# EAGLE design hackerling (EAGLE 6.4)
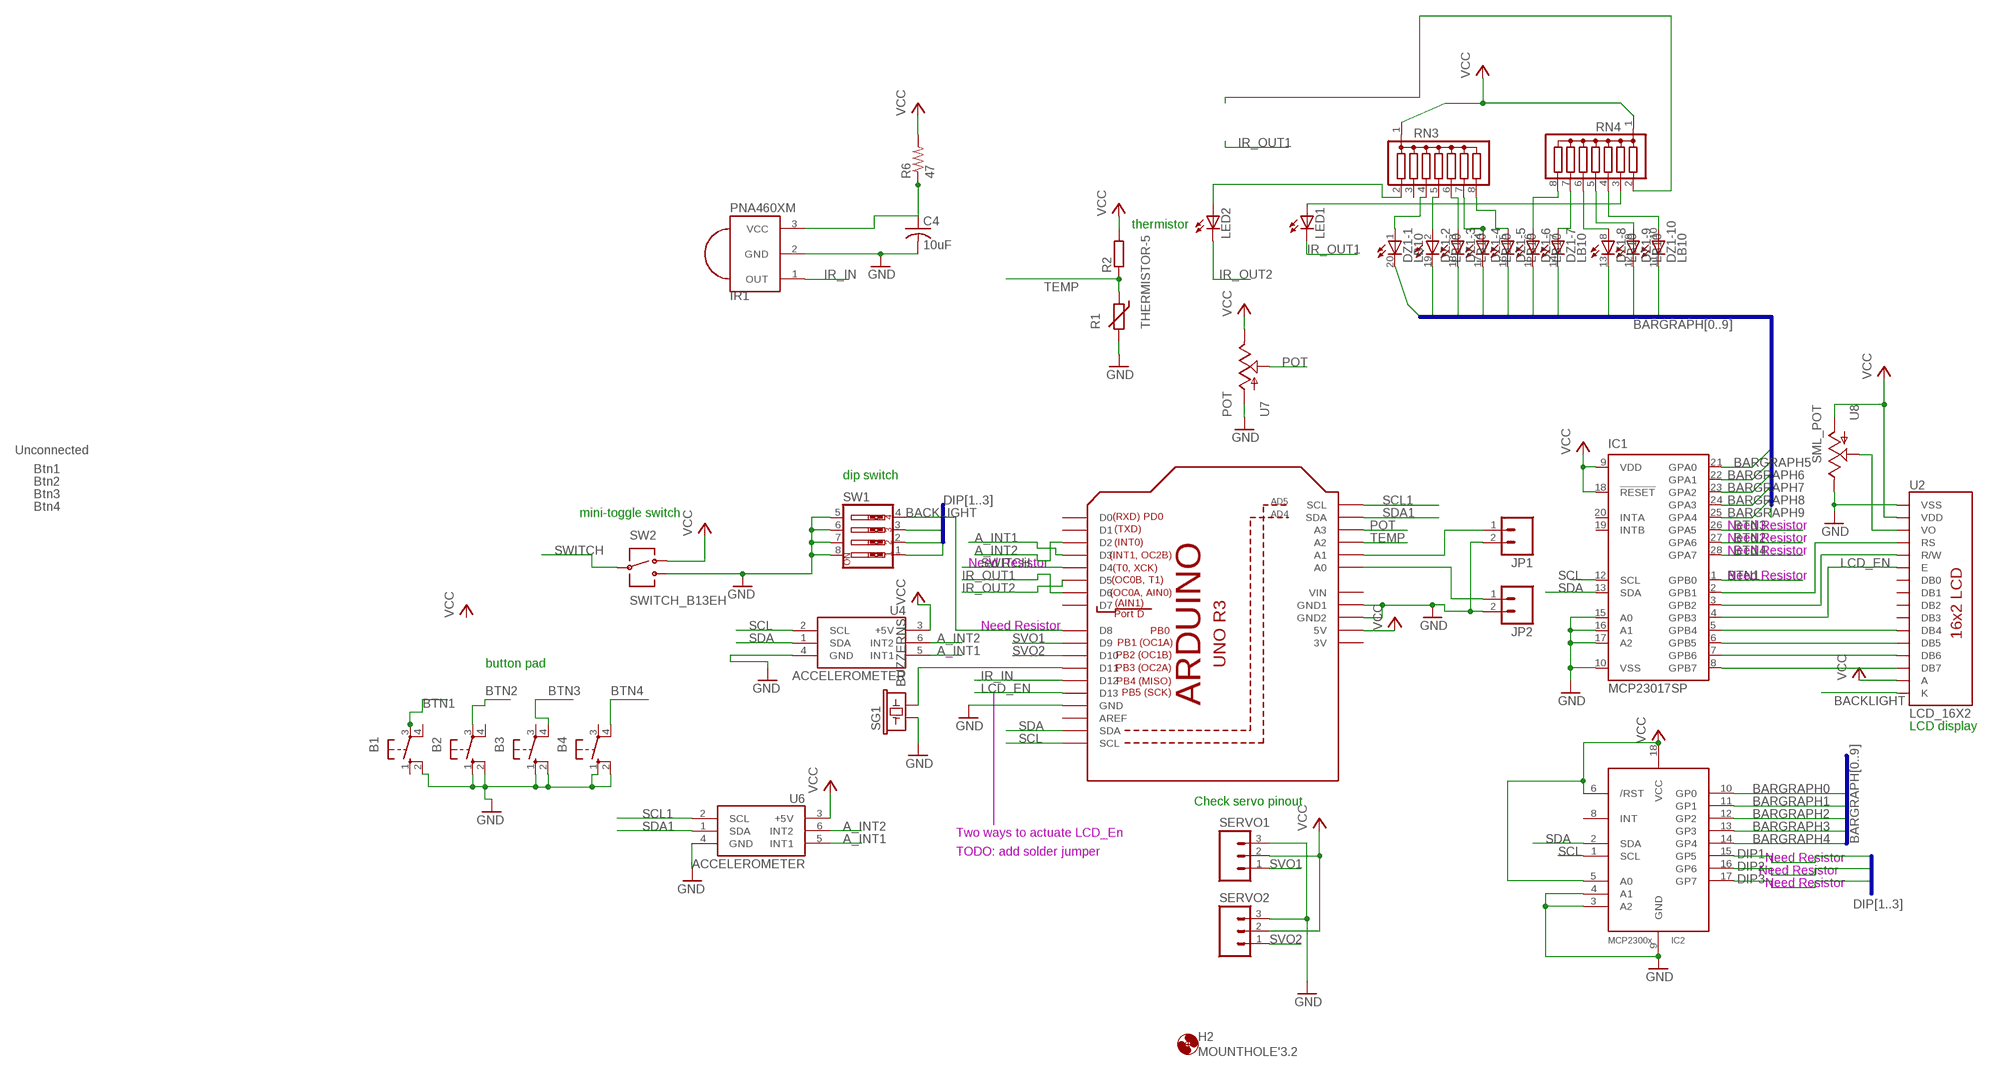
[diagram p0: schematic, sheet 1, part 1 of 2]
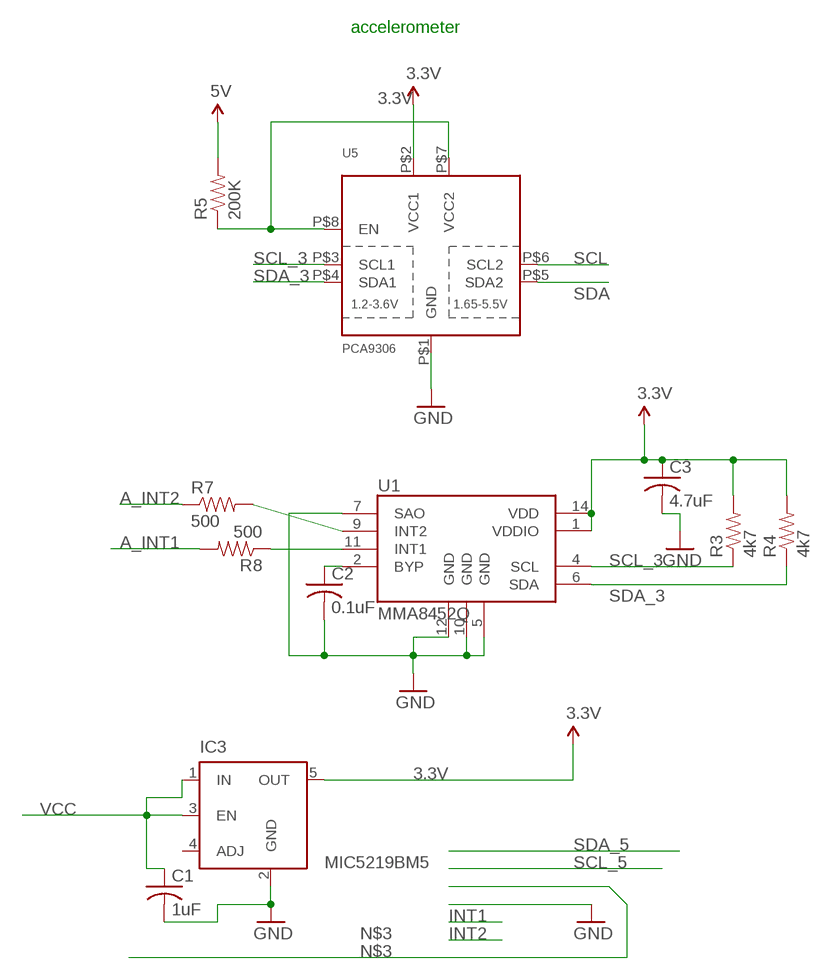
[diagram p1: schematic, sheet 1, part 2 of 2]

## Parts
B1  SWITCH_BCF-4000  [SWITCH_B3F-4000]
B2  SWITCH_BCF-4000  [SWITCH_B3F-4000]
B3  SWITCH_BCF-4000  [SWITCH_B3F-4000]
B4  SWITCH_BCF-4000  [SWITCH_B3F-4000]
C1  1uF  C-USC0603K  [C0603K]
C2  0.1uF  C-USC0603K  [C0603K]
C3  4.7uF  C-USC0603K  [C0603K]
C4  10uF  C-US050-050X075  [C050-050X075]
DZ1  LB10  [LB10]
H2  MOUNTHOLE'3.2  [HOLE_3.2]
IC1  MCP23017SP  [DIL28-3]
IC2  MCP2300X/P  [DIL18]
IC3  MIC5219BM5  [SOT23-5]
IR1  PNA460XM  [PNA460XM]
JP1  M02LOCK  [1X02_LOCK]
JP2  M02LOCK  [1X02_LOCK]
LED1  LED5MM  [LED5MM]
LED2  LED5MM  [LED5MM]
R1  THERMISTOR-5  [R-5]
R2  R-EU_0204/7  [0204/7]
R3  4k7  RESISTOR0603-RES  [0603-RES]
R4  4k7  RESISTOR0603-RES  [0603-RES]
R5  200K  RESISTOR0603-RES  [0603-RES]
R6  47  R-US_0204/7  [0204/7]
R7  500  RESISTOR0603-RES  [0603-RES]
R8  500  RESISTOR0603-RES  [0603-RES]
RN3  G07R  [SIL8]
RN4  G07R  [SIL8]
SERVO1  M03LOCK  [1X03_LOCK]
SERVO2  M03LOCK  [1X03_LOCK]
SG1  BUZZERNS  [BUZZER-12MM-NS]
SW1  SW_DIP-4  [EDG-04]
SW2  SWITCH_B13EH  [SWITCH_B13EH]
U1  MMA8452Q  [QFN-16(5X3)]
U2  LCD_16X2  [LCD_16X2]
U3  ARDUINOR3-BPLACE  [ARDUINOR3-BPLACE]
U4  ACCELEROMETER  [ACCELEROMETER]
U5  PCA9306  [VSSOP-8]
U6  ACCELEROMETER  [ACCELEROMETER]
U7  POT  [ALS_POT]
U8  SML_POT  [SML_POT]

## Nets
3.3V: C3.1 IC3.5(OUT) R3.2 R4.2 U1.1(VDDIO) U1.14(VDD) U5.P$2(VCC1)
A_INT1: R8.2 U3.D3 U4.5(INT1) U6.5(INT1)
A_INT2: R7.1 U3.D2 U4.6(INT2) U6.6(INT2)
BACKLIGHT: SW1.4 U2.16(K) U3.D8
BARGRAPH0: DZ1.20(-1:C) IC2.10(GP0)
BARGRAPH1: DZ1.19(-2:C) IC2.11(GP1)
BARGRAPH2: DZ1.18(-3:C) IC2.12(GP2)
BARGRAPH3: DZ1.17(-4:C) IC2.13(GP3)
BARGRAPH4: DZ1.16(-5:C) IC2.14(GP4)
BARGRAPH5: DZ1.15(-6:C) IC1.21(GPA0)
BARGRAPH6: DZ1.14(-7:C) IC1.22(GPA1)
BARGRAPH7: DZ1.13(-8:C) IC1.23(GPA2)
BARGRAPH8: DZ1.12(-9:C) IC1.24(GPA3)
BARGRAPH9: DZ1.11(-10:C) IC1.25(GPA4)
BTN1: B1.3(P) IC1.1(GPB0)
BTN2: B2.3(P) IC1.27(GPA6)
BTN3: B3.4(P1) IC1.26(GPA5)
BTN4: B4.4(P1) IC1.28(GPA7)
DIP1: IC2.15(GP5) SW1.1
DIP2: IC2.16(GP6) SW1.2
DIP3: IC2.17(GP7) SW1.3
GND: B1.2(S1) B2.1(S) B2.2(S1) B3.1(S) B3.2(S1) B4.1(S) B4.2(S1) C1.2 C2.2 C3.2 C4.2 IC1.10(VSS) IC1.15(A0) IC1.16(A1) IC1.17(A2) IC2.3(A2) IC2.4(A1) IC2.9(GND) IC3.2(GND) IR1.2(GND) JP1.2 JP2.2 R1.2 SERVO1.3 SERVO2.3 SG1.+ SW1.5 SW1.6 SW1.7 SW1.8 SW2.3 U1.5(GND) U1.7(SAO) U1.10(GND) U1.12(GND) U2.1(VSS) U2.B1(VSS) U3.GND U3.GND1 U3.GND2 U4.4(GND) U5.P$1(GND) U6.4(GND) U7.P$1(A) U8.E
IR_IN: IR1.1(OUT) U3.D12
IR_OUT1: LED1.K(C) U3.D6
IR_OUT2: LED2.K(C) U3.D5
LCD_EN: IC1.4(GPB3) U2.6(E) U3.D13
N$1: IC1.8(GPB7) U2.14(DB7)
N$2: IC1.7(GPB6) U2.13(DB6) U2.B13(DB6)
N$3: IC1.6(GPB5) U2.12(DB5) U2.B12(DB5)
N$4: IC1.5(GPB4) U2.11(DB4)
N$5: R5.1 U5.P$7(VCC2) U5.P$8(EN)
N$6: R7.2 U1.9(INT2)
N$7: R8.1 U1.11(INT1)
N$10: IC1.2(GPB1) U2.4(RS)
N$11: IC1.3(GPB2) U2.5(R/W)
N$12: LED2.A RN3.2
N$13: U2.3(VO) U8.S
N$15: SG1.- U3.D11
N$16: LED1.A RN4.3
N$17: DZ1.2(-2:A) RN3.5
N$18: DZ1.1(-1:A) RN3.4
N$19: C4.1 IR1.3(VCC) R6.1
N$20: DZ1.3(-3:A) RN3.6
N$21: DZ1.4(-4:A) RN3.7
N$22: DZ1.5(-5:A) RN3.8
N$23: DZ1.6(-6:A) RN4.8
N$24: JP1.1 U3.A1
N$25: C2.1 U1.2(BYP)
N$26: JP2.1 U3.A0
N$28: DZ1.7(-7:A) RN4.7
N$29: DZ1.8(-8:A) RN4.6
N$30: DZ1.9(-9:A) RN4.5
N$31: DZ1.10(-10:A) RN4.4
N$32: RN4.2
POT: U3.A3 U7.P$2(S)
SCL: IC1.12(SCL) IC2.1(SCL) U3.SCL U4.2(SCL) U5.P$6(SCL2)
SCL1: U3.A5(SCL) U6.2(SCL)
SCL_3: R3.1 U1.4(SCL) U5.P$3(SCL1)
SDA: IC1.13(SDA) IC2.2(SDA) U3.SDA U4.1(SDA) U5.P$5(SDA2)
SDA1: U3.A4(SDA) U6.1(SDA)
SDA_3: R4.1 U1.6(SDA) U5.P$4(SDA1)
SVO1: SERVO1.1 U3.D9
SVO2: SERVO2.1 U3.D10
SWITCH: SW2.2 U3.D4
TEMP: R1.1 R2.1 U3.A2
VCC: C1.1 IC1.9(VDD) IC1.18(!RESET) IC2.5(A0) IC2.6(/RST) IC2.18(VCC) IC3.1(IN) IC3.3(EN) R2.2 R5.2 R6.2 RN3.1 RN4.1 SERVO1.2 SERVO2.2 SW2.1 U2.2(VDD) U2.15(A) U2.B2(VDD) U3.5V U4.3(+5V) U6.3(+5V) U7.P$3(E) U8.A ; supply symbol labelled 5V
Unconnected: B1.1(S) B1.4(P1) B2.4(P1) B3.3(P) B4.3(P) IC1.19(INTB) IC1.20(INTA) IC2.8(INT) IC3.4(ADJ) RN3.3 U2.7(DB0) U2.8(DB1) U2.9(DB2) U2.10(DB3) U3.AREF U3.D0 U3.D1 U3.D7

## Buses
BARGRAPH[0..9]
DIP[1..3]

## Notes on the sheet
- thermistor | accelerometer
- Unconnected
- Btn1
- dip switch
- Btn2
- Btn3
- Btn4
- mini-toggle switch
- Need Resistor
- Need Resistor
- Need Resistor
- Need Resistor
- Need Resistor
- Need Resistor
- button pad
- LCD display
- Check servo pinout
- Two ways to actuate LCD_En
- TODO: add solder jumper
- Need Resistor
- Need Resistor
- Need Resistor

## Power pins joined to a net without a drawn wire
3V: U3.3V
VIN: U3.VIN

## Library data of the parts
B1-B4 = hackerscouts:SWITCH_BCF-4000
C1-C3 = resistor:C-US: CAPACITOR, American symbol
C4 = rcl:C-US: CAPACITOR, American symbol
DZ1 = led:LB10: LED BLOCK 10-LED bar graph, DIL, Siemens
H2 = hackerscouts:MOUNTHOLE
IC1 = adafruit:MCP23017: http://ww1.microchip.com/downloads/en/DeviceDoc/21952a.pdf Source: http://ww1.microchip.com/downloads/en/DeviceDoc/21952a.pdf
IC2 = adafruit:MCP2300X: MCP23008 Inexpensive i2c i/o expander - 8 general purpose i/o pins with optional pullups
IC3 = v-reg-micrel:MIC5219BM5: VOLTAGE REGULATOR; MF: ALTERA CORPORATION; MPN: MIC5219BM5 TR; OC_FARNELL: 1100656; OC_NEWARK: 09J8939
IR1 = adafruit:PNA460XM: IR 38KHz receiver PNA4602 and related receivers http://www.ladyada.net/library/pcb/eaglelibrary.html
JP1 JP2 = SparkFun:M02: Header 2 Standard 2-pin 0.1" header. Use with straight break away headers (SKU : PRT-00116), right angle break away headers (PRT-00553), swiss pins (PRT-00743), machine pins (PRT-00117), and female headers (PRT-00115). Molex polarized connector foot print use with SKU : PRT-08233 with associated crimp pins and housings.
LED1 LED2 = SparkFun:LED: LEDs Standard schematic elements and footprints for 5mm, 3mm, 1206, and 0603 sized LEDs. 5mm - Spark Fun Electronics SKU : COM-00529 (and others)
R1 = varistor:THERMISTOR: THERMISTOR
R2 = resistor:R-EU_: RESISTOR, European symbol
R3-R5 R7 R8 = SparkFun:RESISTOR: Resistor Basic schematic elements and footprints for 0603, 1206, and PTH resistors.
R6 = resistor:R-US_: RESISTOR, American symbol
RN3 RN4 = resistor-sil:G07R: SIL RESISTOR; OC_FARNELL: unknown; OC_NEWARK: unknown
SERVO1 SERVO2 = SparkFun:M03: Header 3 Standard 3-pin 0.1" header. Use with straight break away headers (SKU : PRT-00116), right angle break away headers (PRT-00553), swiss pins (PRT-00743), machine pins (PRT-00117), and female headers (PRT-00115). Molex polarized connector foot print use with SKU : PRT-08232 with associated crimp pins and housings.
SG1 = SparkFun:BUZZER: Buzzer 12mm Spark Fun Electronics SKU : Comp-Buzzer
SW1 = special:SW_DIP-4: DIP SWITCH
SW2 = hackerscouts:SWITCH_B13EH
U1 = hackerscouts:MMA8452Q
U2 = hackerscouts:LCD_16X2
U3 = adafruit:ARDUINOR3: This is a new object for the new Arduino R3 - with extra pins that you may want to use (such as IOref, and duplicated A4/A5
U4 U6 = hackerscouts:ACCELEROMETER
U5 = hackerscouts:PCA9306
U7 = hackerscouts:POT
U8 = hackerscouts:SML_POT

## Board
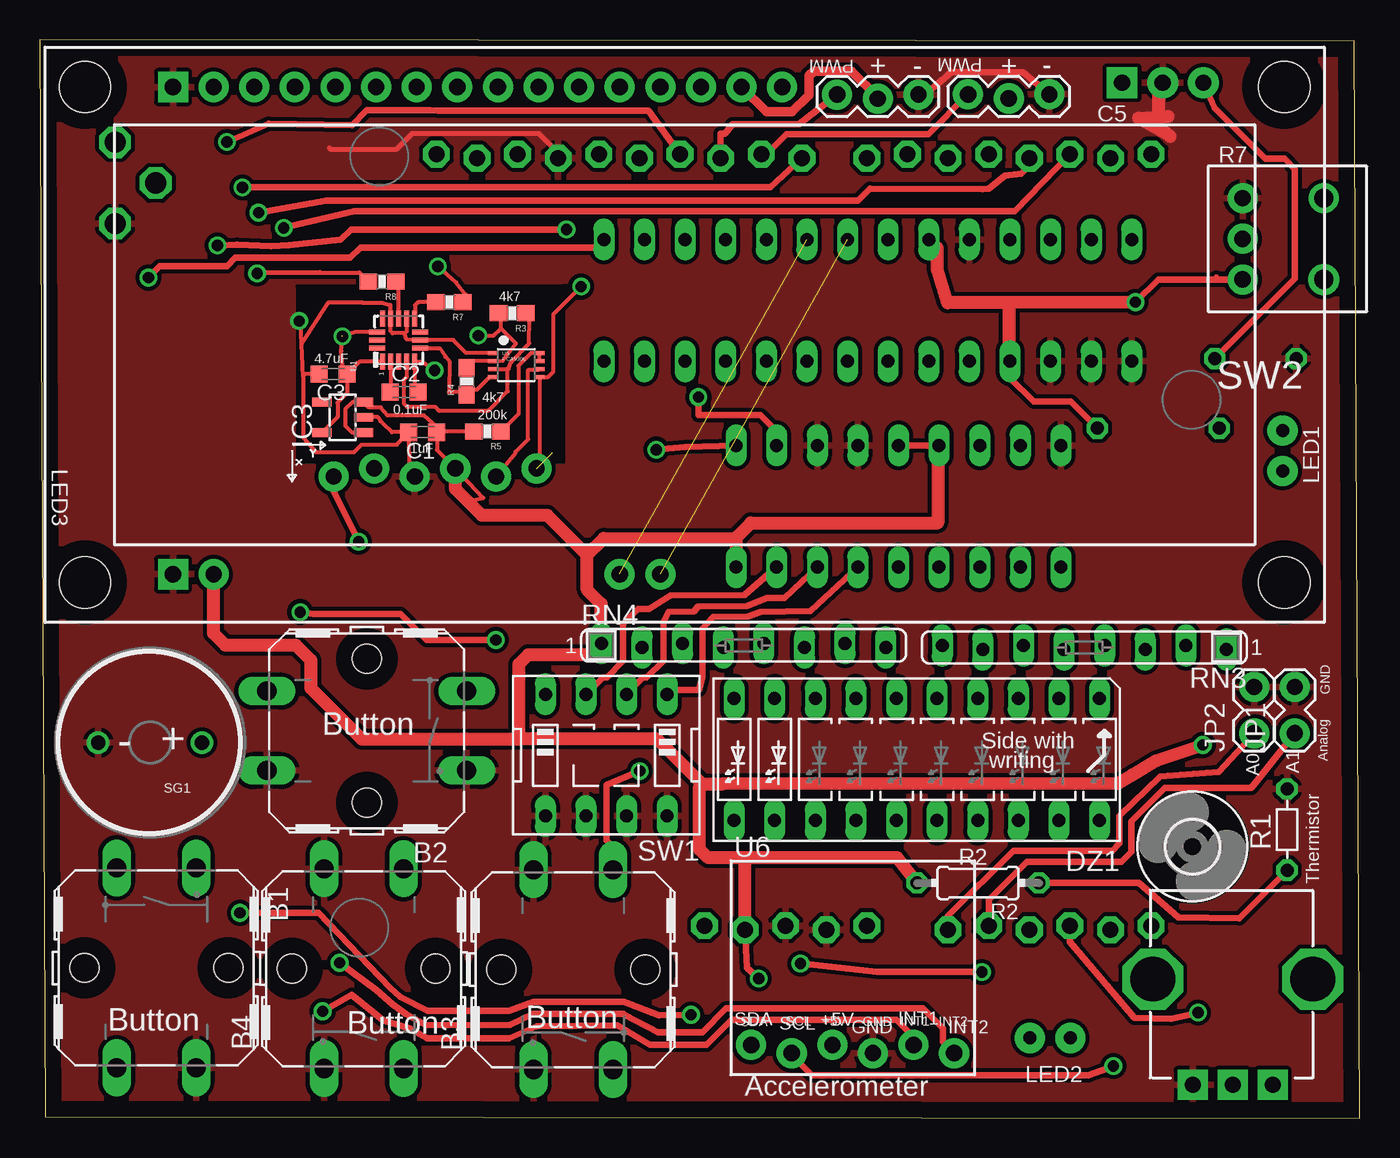
[diagram p2: board, top side]
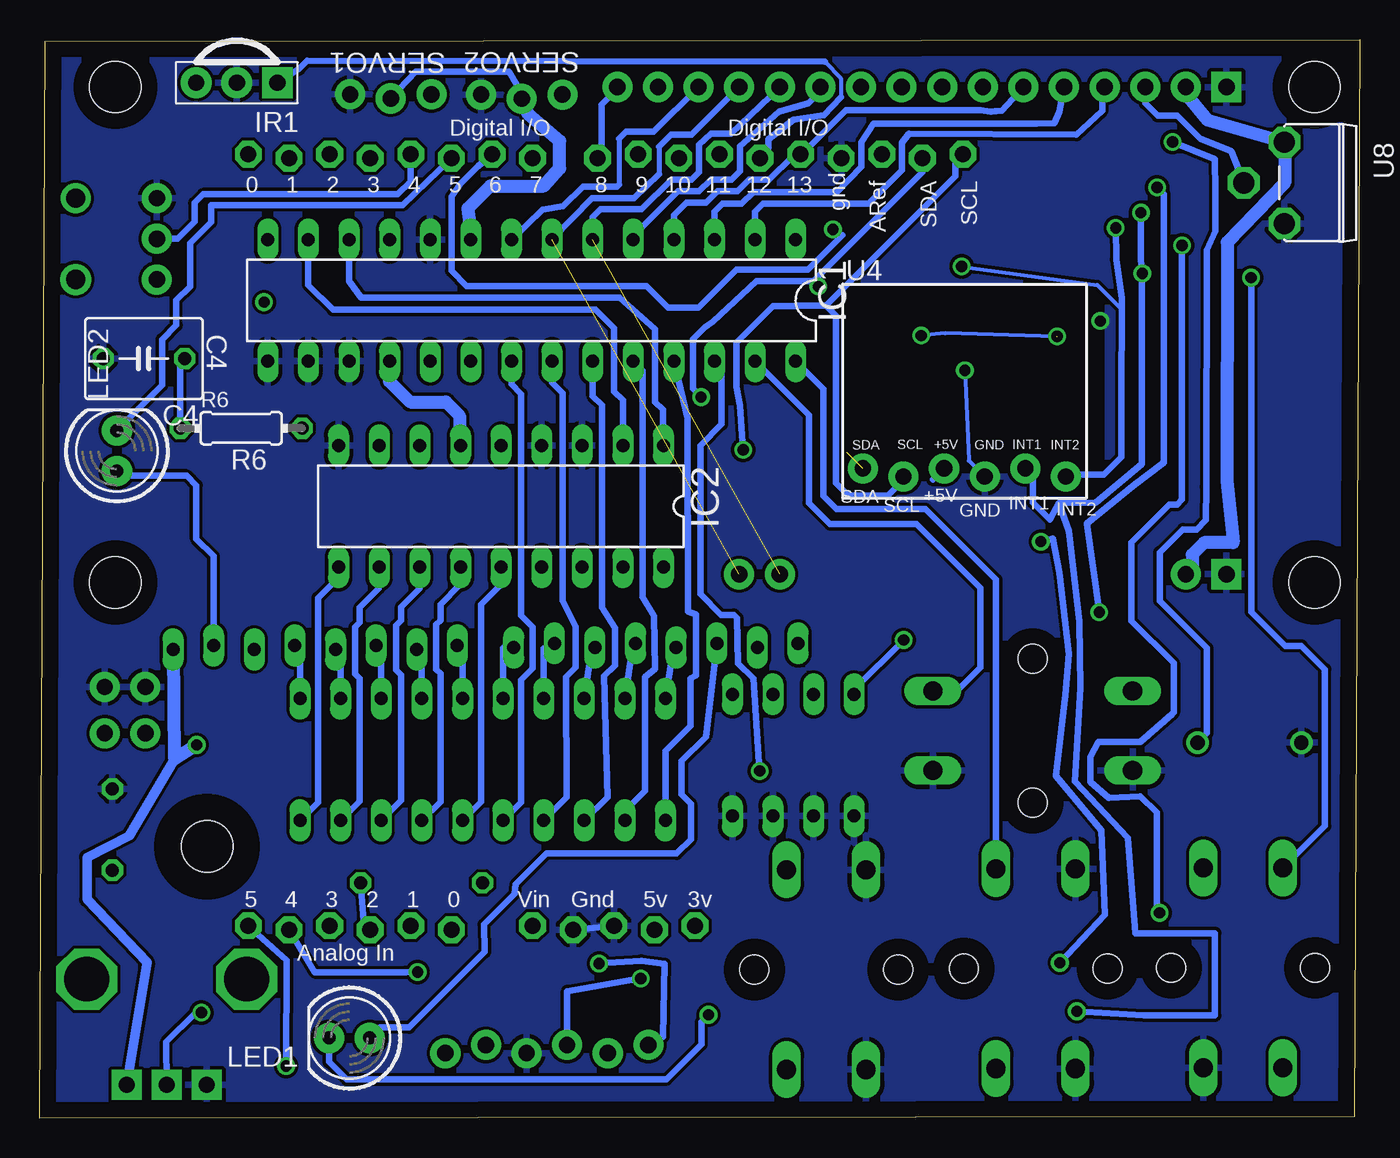
[diagram p3: board, bottom side, seen from below]

Size 82.53 x 67.43 mm. Coordinates in mm from the lower left corner, seen from the top.
Outline: 0,67.43 0.32,0.09 82.53,0 82.21,67.34 0,67.43
Copper layers (1*16): Top 0.035mm / dielectric 1.5mm / Bottom 0.035mm
Design rules "default": minimum track width 10mil, minimum drill 24mil, track to track 8mil, track to pad 8mil, pad to pad 8mil, via to via 8mil, smd to smd 8mil, copper to edge 40mil, drill to drill 8mil, minimum pad ring 10mil, minimum via ring 8mil, stop-mask expansion 3mil, vias tented up to drill 0mil, thermal gap 10mil

### Footprints (pad centres in the part's own frame; a part is rotated, then mirrored left to right if it is on the bottom)
SWITCH_B3F-4000 = drill 1.194 long: 1 -6.248,2.489; 2 6.248,2.489; 3 -6.248,-2.489; 4 6.248,-2.489 | hole 1.803: 0,-4.496; 0,4.496
C0603K = smd 1.05 x 1.08: 1 -0.875,0; 2 0.875,0
C050-050X075 = drill 0.813 octagon: 1 -2.54,0; 2 2.54,0
LB10 = drill 0.813 long: 1 -11.43,-3.81; 2 -8.89,-3.81; 3 -6.35,-3.81; 4 -3.81,-3.81; 5 -1.27,-3.81; 6 1.27,-3.81; 7 3.81,-3.81; 8 6.35,-3.81; 9 8.89,-3.81; 10 11.43,-3.81; 11 11.43,3.81; 12 8.89,3.81; 13 6.35,3.81; 14 3.81,3.81; 15 1.27,3.81; 16 -1.27,3.81; 17 -3.81,3.81; 18 -6.35,3.81; 19 -8.89,3.81; 20 -11.43,3.81
HOLE_3.2 = hole 3.2: 0,0
DIL28-3 = drill 0.813 long: 1 -16.51,-3.81; 2 -13.97,-3.81; 3 -11.43,-3.81; 4 -8.89,-3.81; 5 -6.35,-3.81; 6 -3.81,-3.81; 7 -1.27,-3.81; 8 1.27,-3.81; 9 3.81,-3.81; 10 6.35,-3.81; 11 8.89,-3.81; 12 11.43,-3.81; 13 13.97,-3.81; 14 16.51,-3.81; 15 16.51,3.81; 16 13.97,3.81; 17 11.43,3.81; 18 8.89,3.81; 19 6.35,3.81; 20 3.81,3.81; 21 1.27,3.81; 22 -1.27,3.81; 23 -3.81,3.81; 24 -6.35,3.81; 25 -8.89,3.81; 26 -11.43,3.81; 27 -13.97,3.81; 28 -16.51,3.81
DIL18 = drill 0.813 long: 1 -10.16,-3.81; 2 -7.62,-3.81; 3 -5.08,-3.81; 4 -2.54,-3.81; 5 0,-3.81; 6 2.54,-3.81; 7 5.08,-3.81; 8 7.62,-3.81; 9 10.16,-3.81; 10 10.16,3.81; 11 7.62,3.81; 12 5.08,3.81; 13 2.54,3.81; 14 0,3.81; 15 -2.54,3.81; 16 -5.08,3.81; 17 -7.62,3.81; 18 -10.16,3.81
SOT23-5 = smd 0.55 x 1.2: 1 -0.95,-1.3; 2 0,-1.3; 3 0.95,-1.3; 4 0.95,1.3; 5 -0.95,1.3
PNA460XM = drill 1.016 pad 1.93 square: 1 -2.54,0 | drill 1.016 pad 1.93: 2 0,0; 3 2.54,0
1X02_LOCK = drill 1.016 pad 1.88: 1 -0.178,0; 2 2.718,0
LED5MM = drill 0.813 pad 1.88: A -1.27,0; K 1.27,0
R-5 = drill 0.813 octagon: 1 -2.54,0; 2 2.54,0
0204/7 = drill 0.813 octagon: 1 -3.81,0; 2 3.81,0
0603-RES = smd 1.1 x 1: 1 -0.85,0; 2 0.85,0
SIL8 = drill 0.813 long: 1 -8.89,0.127; 2 -6.35,-0.127; 3 -3.81,0.127; 4 -1.27,-0.127; 5 1.27,0.127; 6 3.81,-0.127; 7 6.35,0.127; 8 8.89,-0.127
1X03_LOCK = drill 1.016 pad 1.88: 1 0,0.127; 2 2.54,-0.127; 3 5.08,0.127
BUZZER-12MM-NS = drill 0.9: + 3.25,0; - -3.25,0
EDG-04 = drill 0.813 long: 1 -3.81,-3.81; 2 -1.27,-3.81; 3 1.27,-3.81; 4 3.81,-3.81; 5 3.81,3.81; 6 1.27,3.81; 7 -1.27,3.81; 8 -3.81,3.81
SWITCH_B13EH = drill 1.016 pad 1.88: 1 0,2.54; 2 0,0; 3 0,-2.54 | drill 1.2 pad 1.88: BR1 -5.08,-2.54 | drill 1.2 pad 1.93: BR2 -5.08,2.54
QFN-16(5X3) = smd 1 x 0.295: 1 -1.35,1; 2 -1.35,0.5; 3 -1.35,0; 4 -1.35,-0.5; 5 -1.35,-1; 9 1.35,-1; 10 1.35,-0.5; 11 1.35,0; 12 1.35,0.5; 13 1.35,1 | smd 0.295 x 1: 6 -0.5,-1.35; 7 0,-1.35; 8 0.5,-1.35; 14 0.5,1.35; 15 0,1.35; 16 -0.5,1.35
LCD_16X2 = drill 1.016 pad 1.88 square: 1 -32,15.5; B1 -32,-14.98 | drill 1.016 pad 1.88: 2 -29.46,15.5; 3 -26.92,15.5; 4 -24.38,15.5; 5 -21.84,15.5; 6 -19.3,15.5; 7 -16.76,15.5; 8 -14.22,15.5; 9 -11.68,15.5; 10 -9.14,15.5; 11 -6.6,15.5; 12 -4.06,15.5; 13 -1.52,15.5; 14 1.02,15.5; 15 3.56,15.5; 16 6.1,15.5; B2 -29.46,-14.98; B12 -4.06,-14.98; B13 -1.52,-14.98 | hole 3.2: -37.5,15.5; -37.5,-15.5; 37.5,15.5; 37.5,-15.5
ARDUINOR3-BPLACE = drill 1 pad 1.676 octagon: 3V 35.56,2.667; 5V 38.1,2.413; A0 50.8,2.413; A1 53.34,2.667; A2 55.88,2.413; A3 58.42,2.667; A4 60.96,2.413; A5 63.5,2.667; AREF 23.876,50.927; D0 63.5,50.927; D1 60.96,50.673; D2 58.42,50.927; D3 55.88,50.673; D4 53.34,50.927; D5 50.8,50.673; D6 48.26,50.927; D7 45.72,50.673; D8 41.656,50.673; D9 39.116,50.927; D10 36.576,50.673; D11 34.036,50.927; D12 31.496,50.673; D13 28.956,50.927; GND 26.416,50.673; GND1 43.18,2.413; GND2 40.64,2.667; SCL 18.796,50.927; SDA 21.336,50.673; VIN 45.72,2.667
ACCELEROMETER = drill 1.016 pad 1.88: 1 -6.35,-4.826; 2 -3.81,-5.334; 3 -1.27,-4.826; 4 1.27,-5.334; 5 3.81,-4.826; 6 6.35,-5.334
VSSOP-8 = smd 0.25 x 0.65: P$1 -0.75,-1.45; P$2 -0.25,-1.45; P$3 0.25,-1.45; P$4 0.75,-1.45; P$5 0.75,1.45; P$6 0.25,1.45; P$7 -0.25,1.45; P$8 -0.75,1.45
ALS_POT = drill 1 pad 1.88 square: P$1 6.3,-2.5; P$2 6.3,0; P$3 6.3,2.5 | drill 2.8 octagon: P$4 -0.318,-5; P$5 -0.318,5
SML_POT = drill 1.321 octagon: A -2.54,0; E 2.54,0; S 0,-2.54

### Placement (x,y rotation side)
B1  7.28,9.39 270 top
B2  20.44,24.22 180 top
B3  33.35,9.28 90 top
B4  20.25,9.34 90 top
C1  23.94,42.9 180 top
C2  22.77,45.41 0 top
C3  18.34,46.54 180 top
C4  76.03,47.5 180 bottom
DZ1  54.84,22.42 180 top
H2  72.08,16.98 270 top
IC1  51.78,51.14 180 bottom
IC2  53.7,38.26 180 bottom
IC3  18.93,43.83 90 top
IR1  70.22,64.76 180 bottom
JP1  78.48,24.24 90 top
JP2  75.94,24.24 90 top
LED1  63.18,5 180 bottom
LED2  77.72,41.73 90 bottom
R1  78,18.04 90 top
R2  58.67,14.7 180 top
R3  29.54,50.33 180 top
R4  26.7,46.08 90 top
R5  27.98,42.95 180 top
R6  69.95,43.14 0 bottom
R7  25.61,51.03 180 top
R8  21.4,52.32 180 top
RN3  65.32,29.43 180 top
RN4  44.01,29.56 0 top
SERVO1  58.05,63.9 0 top
SERVO2  49.86,63.89 0 top
SG1  6.89,23.48 180 top
SW1  35.42,22.69 180 top
SW2  75.22,54.99 180 top
U1  22.43,48.66 90 top
U2  40.32,48.99 0 top
U3  6,9.36 0 top
U4  24.71,45.46 0 bottom
U5  29.8,47.1 270 top
U6  50.83,9.39 0 top
U7  74.6,8.37 270 top
U8  4.7,58.49 270 bottom

### Tracks (layer width: path | path; a pad name or v marks a point on that pad's centre or on a via)
3.3V  (via drill 0.7)  (1 unrouted)
  Top 0.254: C3.1 19.22,45.35 18.61,44.74 18.61,43.85 IC3.5 | U1.1 20,47.31 C3.1 | U1.14 19.73,49.16 18.89,48.9 | C3.1 18.97,46.79 18.85,47.98 v18.92,48.89 | R4.2 26.88,47.35 U5.P$2 28.96,47.36 29.77,48.43 29.77,48.45 28.82,49.39 | 28.82,49.39 28.82,50.19 R3.2 | v27.42,48.95 28.38,48.95 28.82,49.39
  Bottom 0.254: v18.92,48.89 25.91,49.09 v27.42,48.95
A_INT1  (via drill 0.7)
  Top 0.254: 20.58,40.64 U4.5 | 17.5,52.89 19.98,52.89 R8.2
  Top 0.305: 17.5,52.89 v13.58,52.83
  Top 0.406: U3.D3 61.88,59.59 61.37,59.08 60.34,58.93 59.34,58.13 58.96,58.1 51.92,58.14 51.17,57.38 17.91,57.37 v13.67,56.63 | v17.68,6.67 19.5,7.69 21.47,6.12 23.17,5.59 24.22,4.99 29.34,4.97 31.06,5.74 36.12,5.8 38.15,4.57 41.69,4.57 43.25,6.13 53.58,6.13 54.64,5.07 U6.5
  Bottom 0.406: U4.5 20.44,40.18 20.44,38.5 19.36,37.42 18.82,38.47 | 18.82,38.47 16.48,38.49 13.6,40.9 13.62,51.88 13.65,52.99 | v13.67,56.63 13.67,54.04 13.65,52.99 | v17.68,6.67 13.49,6.41 9.04,6.41 9.04,11.56 14.01,11.56 14.5,17.53 17.79,21.04 17.46,26.9 17.51,31.06 18.18,36.7 18.82,38.47 | v13.58,52.83 13.66,52.97 13.65,52.99
A_INT2  (via drill 0.7)
  Top 0.254: v24.89,53.27 26.04,52.27 26.66,51.49 26.46,51.28 R7.1
  Top 0.406: U3.D2 60.99,56.73 19.67,56.73 v15.25,55.68 | v19.93,36.05 18.36,39.21 U4.6 18.36,40.54 18.12,40.78 | v18.74,9.7 21.01,8.03 22.05,7.11 22.86,6.51 24.16,5.81 29.39,5.83 30.85,6.51 36.49,6.51 36.56,6.44 | U6.6 56.47,4.77 56.47,5.62 55.24,6.85 42.92,6.85 41.44,5.37 38.65,5.37 36.56,6.44 | 36.56,6.44 36.4,6.52
  Bottom 0.254: v24.89,53.27 16.4,52.1 14.87,50.57
  Bottom 0.406: v15.25,55.68 15.22,53.69 14.87,51.29 14.87,50.57 14.89,45.36 14.89,41.34 15.99,40.24 18.25,40.24 U4.6 | v19.93,36.05 19.17,36.26 18.77,34.12 18.17,29.02 18.41,26.47 18.98,21.4 16.15,17.99 15.92,12.71 v18.74,9.7
BACKLIGHT  (via drill 0.7)
  Top 0.406: SW1.4 31.61,26.87 | U3.D8 45.71,58.21 v12.66,58.21 | v16.28,31.64 17.12,31.53 22.55,31.53 24.18,29.9 v28.51,29.9
  Bottom 0.406: U3.D8 47.42,60.4 47.42,63.37 46.42,64.37 U2.16 | v12.66,58.21 12.24,57.79 12.24,40.99 14.18,39.54 | 14.18,39.54 13.86,39.78 | 14.18,39.54 17.06,37.17 v16.28,31.64 | v28.51,29.9 31.61,26.8 SW1.4
BARGRAPH0
  Bottom 0.406: DZ1.20 65.14,19.74 65.14,32.53 63.88,33.79 IC2.10
BARGRAPH1
  Bottom 0.406: DZ1.19 62.54,19.8 62.53,27.48 62.83,27.78 62.83,30.7 62.54,30.99 62.54,31.92 61.34,33.12 IC2.11
BARGRAPH2
  Bottom 0.406: DZ1.18 59.94,19.86 59.94,27.7 60.27,28.03 60.27,30.79 59.94,31.12 59.94,31.97 58.8,33.11 IC2.12
BARGRAPH3
  Bottom 0.406: DZ1.17 57.49,19.77 57.49,27.79 57.76,28.06 57.76,30.86 57.49,31.13 57.49,32.13 56.26,33.36 IC2.13
BARGRAPH4
  Bottom 0.406: DZ1.16 54.94,19.78 54.94,32.13 53.72,33.35 IC2.14
BARGRAPH5
  Bottom 0.406: DZ1.15 52.44,19.74 52.44,27.39 51.72,28.11 51.72,30.71 52.45,31.44 52.44,45.29 53.05,45.9 IC1.21
BARGRAPH6
  Bottom 0.406: DZ1.14 49.59,20.05 49.62,27.6 49.04,28.18 49.04,30.73 49.84,32.38 49.84,45.34 50.51,46.01 IC1.22
BARGRAPH7
  Bottom 0.406: DZ1.13 47.04,20.06 47.25,27.64 46.57,28.32 46.57,30.66 47.39,31.92 47.39,44.59 47.97,45.17 IC1.23
BARGRAPH8
  Bottom 0.406: IC1.24 44.84,46.74 44.84,32.58 44.12,31.39 44.08,28.09 44.69,27.57 44.69,20.46 45.95,19.2 DZ1.12
BARGRAPH9
  Bottom 0.406: IC1.25 42.02,43.79 42.01,31.69 41.51,31.5 41.51,27.68 41.84,27.48 41.84,24.52 43.41,22.95 DZ1.11
BTN1  (via drill 0.7)
  Top 0.406: IC1.1 34.77,54.45 20.04,54.45 19.39,53.8 12.21,53.8 11.7,53.29 7.5,53.29 v6.78,52.57
  Bottom 0.406: B1.3 2.16,18.27 2.16,28.06 3.63,29.53 4.65,29.53 6.78,31.66 v6.78,52.57
BTN2
  Bottom 0.406: IC1.27 34.45,43.97 34.45,38.48 33.11,37.14 27.7,37.14 23.7,33.14 23.7,28.18 25.17,26.71 B2.3
BTN3  (via drill 0.7)
  Top 0.406: v37.52,21.7 35.43,20.83 35.43,17.35 35.84,16.94 B3.4
  Bottom 0.406: IC1.26 39.9,46.88 39.9,43.39 41.23,42.06 41.23,32.77 39.93,31.47 39.13,31.47 38.93,31.27 38.87,28.44 37.92,27.49 v37.52,21.7
BTN4
  Bottom 0.406: IC1.28 33.54,45.6 33.54,38.91 32.71,38.08 27.14,38.08 22.74,33.68 B4.4
DIP1
  Top 0.406: IC2.15 48.18,31.71 45.05,31.65 44.29,31.37 42.1,31.35 41.45,30.61 41.45,27.63 41.22,26.78 39.51,26.78 SW1.1
DIP2
  Top 0.406: IC2.16 46.57,32.52 45.48,32.52 44.22,32.03 41.17,32 40.92,31.67 39.32,31.66 39,31.03 39,28.6 37.94,27.54 37.73,27.54 SW1.2
DIP3
  Top 0.406: IC2.17 44.05,32.7 39.44,32.67 38.09,31.83 37.42,31.83 36.48,30.89 36.48,28.58 35.46,27.56 35.21,27.56 SW1.3
GND  (via drill 0.7, 0.7 pad 0.3)
  Top 0.254: 16.47,46.34 16.37,48.43 | 16.37,48.43 16.31,49.63 | v16.21,49.86 16.21,49.98 | C1.2 22.02,42.89 21.49,43.42 21.3,43.58 21.14,43.84 20.25,43.84 IC3.2 | C1.2 23.09,40.48 U4.4 | U5.P$1 26.66,47.85 25.84,48.66 U1.7 22.95,48.7 22.82,49.08 | C3.2 16.47,46.54 16.47,46.34 | 16.47,46.34 16.47,42.57 17.27,41.65 19.64,41.65 20.11,42.12 22.31,42.12 C1.2 | C2.2 23.43,45.62 U1.5 23.88,47.31 v24.68,46.77 | U1.10 22.93,49.2 22.82,49.08 | 22.82,49.08 22.05,49.08 21.94,49.2 U1.12 21.91,50.03 21.91,50.85 21.41,51 20.17,50.99 18.02,50.99 16.37,48.43
  Top 0.305: U3.GND 32.42,60.38 31.21,61.58 23.27,61.58 22.27,60.58 18.19,60.58 18.09,60.68
  Top 0.406: SERVO2.3 55.34,64 57.02,65.42 61.48,65.42 SERVO1.3
  Top 0.813: IR1.2 69.94,64.49 69.94,62.2 69.82,62.11 70.7,61.41 68.7,62.55 70.57,62.66
  Bottom 0.254: 23.08,40.49 U4.4 24.43,41.12 v24.68,46.77
  Bottom 0.406: U3.GND2 U3.GND1 | 58.13,55.29 IC1.10 | 23.81,40.5 U4.4
  Bottom 0.813: 49.24,11.96 U3.GND1
  pour Top (isolate 0.254): 0.49,66.65 0.83,0.33 81.79,0.62 81.82,66.76
  pour Bottom: 0.44,66.64 0.47,0.42 81.99,0.44 82.02,66.76
IR_IN
  Bottom 0.254: 33.43,66.07 32.45,65.03 32.45,63.84
  Bottom 0.406: 32.45,63.84 33.5,62.73 35.41,62.43 36.97,61.21 36.97,60.69 U3.D12 | 33.43,66.07 65.82,66.12 66.31,65.63 IR1.1
IR_OUT1  (via drill 0.7)
  Top 0.406: v32.94,55.58 19.45,55.58 18.8,54.93 15.6,54.6 14.45,54.53 12.32,54.62 v11.1,54.58 | v40.72,6.45 38.71,6.41 36.52,7.25 30.87,7.25 29.34,6.7 24.23,6.7 22.54,7.59 21.89,8.15 17.42,12.83 v12.51,12.83
  Bottom 0.406: v32.94,55.58 32.59,55.23 32.33,55.23 34.51,53.05 38.97,53.05 41.34,50.68 43.24,50.68 44.6,52.04 55.84,52.04 56.8,53 56.8,57.62 56.26,58.42 55.13,59.55 U3.D6 | LED1.K 64.45,3.51 63.35,2.41 43.35,2.41 41.16,4.6 41.16,6.01 v40.72,6.45 | v11.1,54.58 11.1,38.67 11.41,38.36 11.9,38.36 14.26,36 14.26,31.09 11.62,28.45 11.62,25.36 11.7,25.28 13.71,23.51 16.32,23.51 16.85,22.58 16.85,21.03 15.69,20.02 13.7,20.11 12.69,19.1 12.69,13.01 v12.51,12.83
IR_OUT2
  Bottom 0.406: LED2.K 74.89,45.83 74.89,48.69 74,49.58 74,51.16 73.15,52.01 73.15,54.72 71.84,56.03 71.84,57.11 59.85,57.11 U3.D5
LCD_EN
  Bottom 0.406: U2.6 22.38,63.01 23.06,62.95 | 23.06,62.95 22.8,62.96 | IC1.4 42.89,56.46 42.11,57.24 40.89,57.24 40.16,57.97 38.9,57.97 38.19,58.68 36.93,58.68 35.45,60.16 U3.D13 34.96,60.2 32.11,63.04 23.72,63.04 23.06,62.95
N$1
  Bottom 0.305: 46.33,61.24 46.33,58.37
  Bottom 0.406: U2.14 44.15,61.68 45.89,61.68 46.33,61.24 | 46.33,58.37 46.45,58.25 48.58,58.25 49.81,57.02 51.11,56.83 IC1.8
N$2  (1 unrouted)
  Bottom 0.305: 43.81,60.76 43.81,59.05
  Bottom 0.406: U2.13 41.77,61.52 43.05,61.52 43.81,60.76 | 43.81,59.05 45.38,57.54 47.99,57.54 IC1.7
N$3  (1 unrouted)
  Bottom 0.406: U2.12 39.3,61.58 40.56,61.58 41.31,60.88 41.31,59.16 41.77,58.7 43.04,58.7 44.9,56.84 47.47,56.84 47.97,56.34 IC1.6
N$4
  Bottom 0.406: IC1.5 45.43,55.16 42.63,57.96 41.3,57.96 40.56,58.7 39.28,58.7 38.75,59.23 38.75,60.78 36.3,62.95 34.46,63.46 33.72,64.2 U2.11
N$5
  Top 0.254: U5.P$7 U5.P$8 30.72,47.85 29.93,47.05 29.93,44.04 R5.1
N$6
  Top 0.254: R7.2 23.66,51.03 23.45,50.83 23.45,50.03 U1.9
N$7
  Top 0.254: U1.11 22.43,52.13 R8.1
N$10
  Bottom 0.406: IC1.2 37.81,56.68 37.31,57.18 30.73,57.18 28.61,59.3 28.61,61 28.18,61.56 17.71,61.5 16.1,63.02 16.1,64.33 U2.4
N$11
  Bottom 0.406: U2.5 18.77,62.94 19.09,62.21 20.22,62.19 30.39,62.19 31.15,61.03 31.15,59.5 32.7,57.91 37.92,57.91 38.65,57.18 39.85,57.18 40.35,56.68 IC1.3
N$12
  Bottom 0.406: RN3.2 71.67,35.14 72.75,36.22 72.75,39.57 73.36,40.18 77.44,40.18 LED2.A
N$13
  Bottom 0.406: U2.3 13.4,63.47 12.62,62.69 11.39,62.69 9.95,61.25 8.03,60.47 U8.S
N$14
  cutout Top: 16.11,52.01 16.11,41.02 32.74,41.05 32.74,52.04
  cutout Bottom: 16.09,51.96 16.09,40.97 32.74,41.05 32.74,52.04
N$15  (via drill 0.7)
  Top 0.406: U3.D11 38.07,63.02 24.91,63.02 24.41,63.03 20.44,63.03 19.52,62.11 14.3,62.2 v11.69,61.05
  Bottom 0.406: v11.69,61.05 9.04,59.97 9.01,57.98 9.01,55.46 9.55,54.28 9.59,39.49 9.6,37.41 10.18,36.82 11.05,36.82 12.5,35.37 12.5,32.34 9.55,29.39 9.55,24.07 SG1.- 9.64,23.98
N$16
  Bottom 0.406: RN4.3 40.89,23.84 42.4,22.33 42.4,20.23 41.82,19.65 41.82,17.43 42.71,16.54 50.85,16.54 52.78,14.61 52.84,14.03 54.77,12.1 54.71,10.39 59.44,5.66 61.25,5.66 LED1.A
N$17
  Bottom 0.406: RN3.5 63.73,29.11 DZ1.2
N$18
  Bottom 0.406: DZ1.1 66.27,29.4 66.3,29.43 RN3.4
N$19
  Top 0.406: 72.04,65.07 IR1.3 73.49,63.15 76.65,59.99 77.85,59.99 78.49,59.35 78.49,52.5 C4.1
  Bottom 0.406: R6.1 73.76,47.23 C4.1
N$20
  Bottom 0.406: DZ1.3 61.19,29.4 61.22,29.43 RN3.6
N$21
  Bottom 0.406: DZ1.4 58.65,29.4 58.68,29.43 RN3.7
N$22
  Bottom 0.406: DZ1.5 56.11,29.4 56.14,29.43 RN3.8
N$23
  Bottom 0.406: DZ1.6 53.57,29.4 RN4.8
N$24
  Top 0.406: U3.A1 59.34,13.64 61.72,16.02 67.64,16.02 68.26,16.64 68.26,18.55 70.37,20.66 75.77,20.66 JP1.1
N$25
  Top 0.254: U1.2 21.93,45.44 C2.1
N$26
  Top 0.406: U3.A0 56.8,12.64 60.88,16.72 67.06,16.72 67.51,17.17 67.51,18.89 70.09,21.37 73.74,21.66 JP2.1
N$28
  Bottom 0.406: RN4.7 51.03,29.38 DZ1.7
N$29
  Bottom 0.406: RN4.6 48.15,28.43 DZ1.8
N$30
  Bottom 0.406: RN4.5 45.62,28.41 DZ1.9
N$31
  Bottom 0.406: RN4.4 42.94,29.22 DZ1.10
POT  (via drill 0.7)
  Top 0.406: U3.A3 64.42,11.01 68.44,6.25 70.75,6.2 v72.44,6.59
  Bottom 0.406: U7.P$2 74.63,4.75 72.83,6.55 v72.44,6.59
SCL  (via drill 0.7)
  Top 0.254: U4.2 29.74,41.59 29.74,41.66 30.54,42.45 30.54,46.77 30.57,46.81 31.2,46.81 U5.P$6
  Top 0.406: v38.55,41.8 40.35,41.97 IC2.1 | U4.2 28.52,40.54
  Bottom 0.406: U3.SCL 25.28,59.68 25.28,58.91 33.37,50.82 | 33.37,50.82 35.13,50.82 35.16,50.79 36.69,50.79 38.98,48.5 38.98,45.71 38.74,44.56 v38.55,41.8 | IC1.12 63.21,52.34 62.46,51.31 46.3,51.31 44.05,49.34 44.05,44.78 43.57,44.3 43.57,41.98 IC2.1 | 33.37,50.82 32.75,50.2 32.75,39.7 31.98,38.93 29.49,38.93 28.52,39.9 U4.2
SCL1  (via drill 0.7)
  Top 0.406: v67.13,3.25 65.58,2.66 48.29,2.66 47.02,3.93 U6.2
  Bottom 0.406: U3.A5 67.09,9.88 v67.13,3.25
SCL_3
  Top 0.254: U5.P$3 29.2,46.85 | 29.2,46.85 29.22,46.85 29.32,46.87 29.47,47.27 30.6,48.45 30.63,50.09 R3.1 | U1.4 22.93,46.35 22.75,46.17 22.75,44.69 22.95,44.5 24.71,44.5 24.95,44.26 28.05,44.26 29.25,45.46 29.25,46.8 29.2,46.85
SDA  (via drill 0.7)  (1 unrouted)
  Top 0.254: U4.1 31.25,40.83 U5.P$5 31.78,46.35 32.11,46.68 32.11,50.27 v33.85,52.01
  Top 0.406: U4.1 31.06,41.05 | IC2.2 46.1,42.92 45.05,43.97 41.18,43.97 v41.18,45.09
  Bottom 0.406: IC1.13 65.75,52.1 64.2,50.55 47.78,50.55 46.63,49.4 46.63,45.45 46.07,44.89 46.07,42 IC2.2 | 34.16,52.34 37.71,52.36 40.44,49.8 40.97,49.44 41.7,48.71 41.7,45.61 v41.18,45.09 | U3.SDA 27.34,59.17 34.16,52.34 | 34.16,52.34 33.85,52.03 v33.85,52.01
SDA1  (via drill 0.7)
  Top 0.406: v58.92,9.13 52.35,9.13 v47.56,9.66
  Bottom 0.406: U3.A4 65.34,9.12 59.67,9.12 v58.92,9.13 | v47.56,9.66 44.92,9.84 43.46,9.64 43.56,5.09 U6.1
SDA_3
  Top 0.254: U5.P$4 28.12,46.35 27.31,45.54 26.77,45.54 R4.1 26.29,45.44 25.59,45.44 25.61,47.32 25.36,47.62 24.98,48.15 U1.6
SVO1
  Top 0.406: SERVO1.1 55.56,61.54 46.69,61.54 45.31,60.16 U3.D9 45.12,60.6
SVO2
  Top 0.406: U3.D10 42.58,61.57 42.85,61.57 43.32,62.16 47.47,62.16 SERVO2.1
SWITCH
  Bottom 0.406: 75.31,54.8 75.22,54.89 SW2.2 73.91,55 72.86,56.05 72.86,57.24 72.33,57.77 60.15,57.77 59.34,58.58 U3.D4
TEMP
  Top 0.406: R1.1 75,12.5 71.2,12.56 68.72,14.7 R2.1
  Bottom 0.406: R2.1 62.3,12.32 U3.A2
VCC  (via drill 0.7)
  Top 0.254: 26.01,40.64 26.01,40.68 | 27.07,38.66 27.73,38.78 U4.3 24.84,41.78 C1.1 | R5.2 24.89,42.95 C1.1 | IC3.1 20.22,42.89 19.51,42.89 19.1,43.3 19.1,44.34 19.54,44.78 IC3.3 20.57,44.45 21.32,44.45 21.73,43.95 24.02,43.95 24.84,43.23 C1.1
  Top 0.406: v44.96,8.73 44.22,9.38 U3.5V | U4.3 26.01,40.64 26.45,41.08 | 73.7,52.45 SW2.1 75,52.45 | 73.7,52.45 69.94,52.45 v68.52,51.03 | IC2.5 IC2.6 56.29,41.97 | 26.01,40.68 25.35,40.68 | 73.59,52.56 73.7,52.45 | R6.2 64.48,44.8 62.16,44.8 60.67,46.29 IC1.18
  Top 0.61: U2.15 45.44,62.93 47.04,62.93 48.09,63.98 48.09,65.18 48.4,65.49 50.77,65.49 52.4,63.86 SERVO2.2
  Top 0.813: IC2.18 43.56,36.31 | 43.56,36.31 44.47,37.22 56.16,37.22 56.16,41.84 56.29,41.97 | v68.52,51.03 60.64,51.01 | 60.64,51.01 56.77,51 56.12,53.07 56.12,54.42 IC1.9 | v72.73,23.33 69.84,22.36 68.33,21.47 67.41,20.93 67.37,20.93 42.67,20.89 41.41,20.89 | R2.2 53.62,16.27 44.11,16.27 | 44.11,16.27 41.79,16.27 41.26,16.8 41.26,20.74 41.41,20.89 | 34.22,35.21 34.22,33.03 35.1,32.15 RN4.1 34.55,28.97 30.53,28.97 29.94,28.38 29.94,23.7 | 34.22,35.21 35.27,36.26 43.51,36.26 43.56,36.31 | 34.22,35.21 31.74,37.69 27.64,37.69 25.98,39.35 U4.3 | IC1.18 60.64,47.36 60.64,51.01 | 41.41,20.89 38.6,23.7 29.94,23.7 | U2.B2 10.86,30.31 11.6,29.57 16.01,29.57 16.95,28.63 16.95,26.87 20.12,23.7 29.94,23.7 | U3.5V 44.11,11.91 44.11,16.27
  Bottom 0.406: IC1.9 55.51,55.03 | U4.3 26.69,39.93 | SERVO2.2 52.3,63.92 53.2,65.45 59.04,65.45 SERVO1.2 | RN3.1 74.21,23.72 | U6.3 49.56,7.93 v44.96,8.73
  Bottom 0.61: U7.P$3 75.84,9.73 79.58,13.67 79.58,16.3 76.96,17.65 74.1,22.46
  Bottom 0.813: 55.51,55.03 55.77,56.9 54.38,58.29 51.03,58.3 50.03,59.41 50.03,61.1 51.97,62.76 SERVO2.2 | RN3.1 74.17,29.39 74.1,22.46 v72.73,23.33 | U2.2 10.86,64.05 9.51,62.42 U8.A 4.68,61.01 4.68,58.48 8.27,54.76 8.29,39.83 7.9,35.99 9.71,35.99 10.47,35.23 10.47,34.4 U2.B2 | IC1.18 60.67,46.07 59.38,44.78 57.14,44.78 56.29,43.93 56.29,42 IC2.6

### Text on the board
tPlace: PWM | PWM | + | - | + | - | C5 | R7 | 4k7 | 4.7uF | 0.1uF | 4k7 | 200k | 1uF | LED3 | LED1 | GND | Button | - | + | Side with | writing | A1 | Analog | A0 | R2 | Thermistor | +5V | INT1 | Button | SDA | GND | INT2 | Button | Button | SCL | LED2 | Accelerometer
bPlace: C4 | R6 | INT1 | +5V | INT2 | GND | SCL | SDA
Reference: Keep this open for servo, LED access | 24mm | 82.09 | shield + LCD | 77.52, 64.39 | LCD Board | LCD screen | USB B port | Switch - sticks out the side | 41.00 -> 53.75 | This LED points out this side | 77.49, 33.46 | shield + LCD | Buzzer | 67.25, 27.44 | Can be covered | LED Bar Graph | 2.46, 33.43 | 67.38 | shield + LCD | 41.83, 17.27 | 77.86, 16.91 | Arduino+shield | Knob for potentiometer | Power Jack | 74.30, 8.30 | 11.75 -> 21.75 | 0.00, 0.00 | 62.86 | 19.94, 9.27 | 33.04, 9.22 | 6.97, 9.32 | This LED points out this side | 20.15, 24.12 | Buttons. 12mm square heads | All Dimensions in mm
binstruct: Install Pot. | Step 9: | Step 10: | IR reciever | here | Step | 8: | Step 7: | Install | here | switch | match up | Step 1: | Place MCP23017 here. | the indent | Solder on the other side. | Step 6 | Step 5 | Step | 18 | match up | the indent | Step 2: | See | Place MCP2300 here. | Other | Solder on the other side. | Step 20: | Side | Step | 19
tInstruct: Step 3: Install Arduino headers, pointing down. | Solder on this side. | Install this chip | Step 0: | This circuit may | on the other side | be pre-installed | If not, install a | daughter board | as last step | For steps | 18,19,20: | Install this chip | Solder LEDs | on the other side | 1/4 inch away | from board | arrow | goes | arrow | here | goes | here | Step 11: | Install resistor arrays | Step 13: | Step | Step 22: | Step 14: | 21 | Bargraph | Speaker | Step 15 | Step 12: | 16: | Step | Install 4 buttons | Step 4: | Headers | pointing down | Step 17: | potentiometer
bGeneralInstruct: Hackerling | Circuit | 1.1 | v | For information about | this circuit, | or the Hacker Scouts | program, | This Circuit is Open Source! | go to: | circuit.hacker-scouts.org | www.hacker-scouts.org